# Altium schematic sheet KST-51开发板原理图.SchDoc: STM32F107 Core Board
size 469 x 297 mm; Organization: Kingst; DocumentNumber: CB3201; Revision: 1.00.00; SheetNumber: 1; SheetTotal: 1; PageSetup: Record=PageOptions|CenterHorizontal=True|CenterVertical=True|PrintScale=0.85|XCorrection=1.00|YCorrection=1.00|PrintKind=2|BorderSize=5000000|LeftOffset=0|BottomOffset=0|Orientation=2|PaperLength=4200|PaperWidth=2970|Scale=100|PaperSource=15|PrintQuality=300|MediaType=1|DitherType=10|PaperKind=A3|PrintScaleMode=1
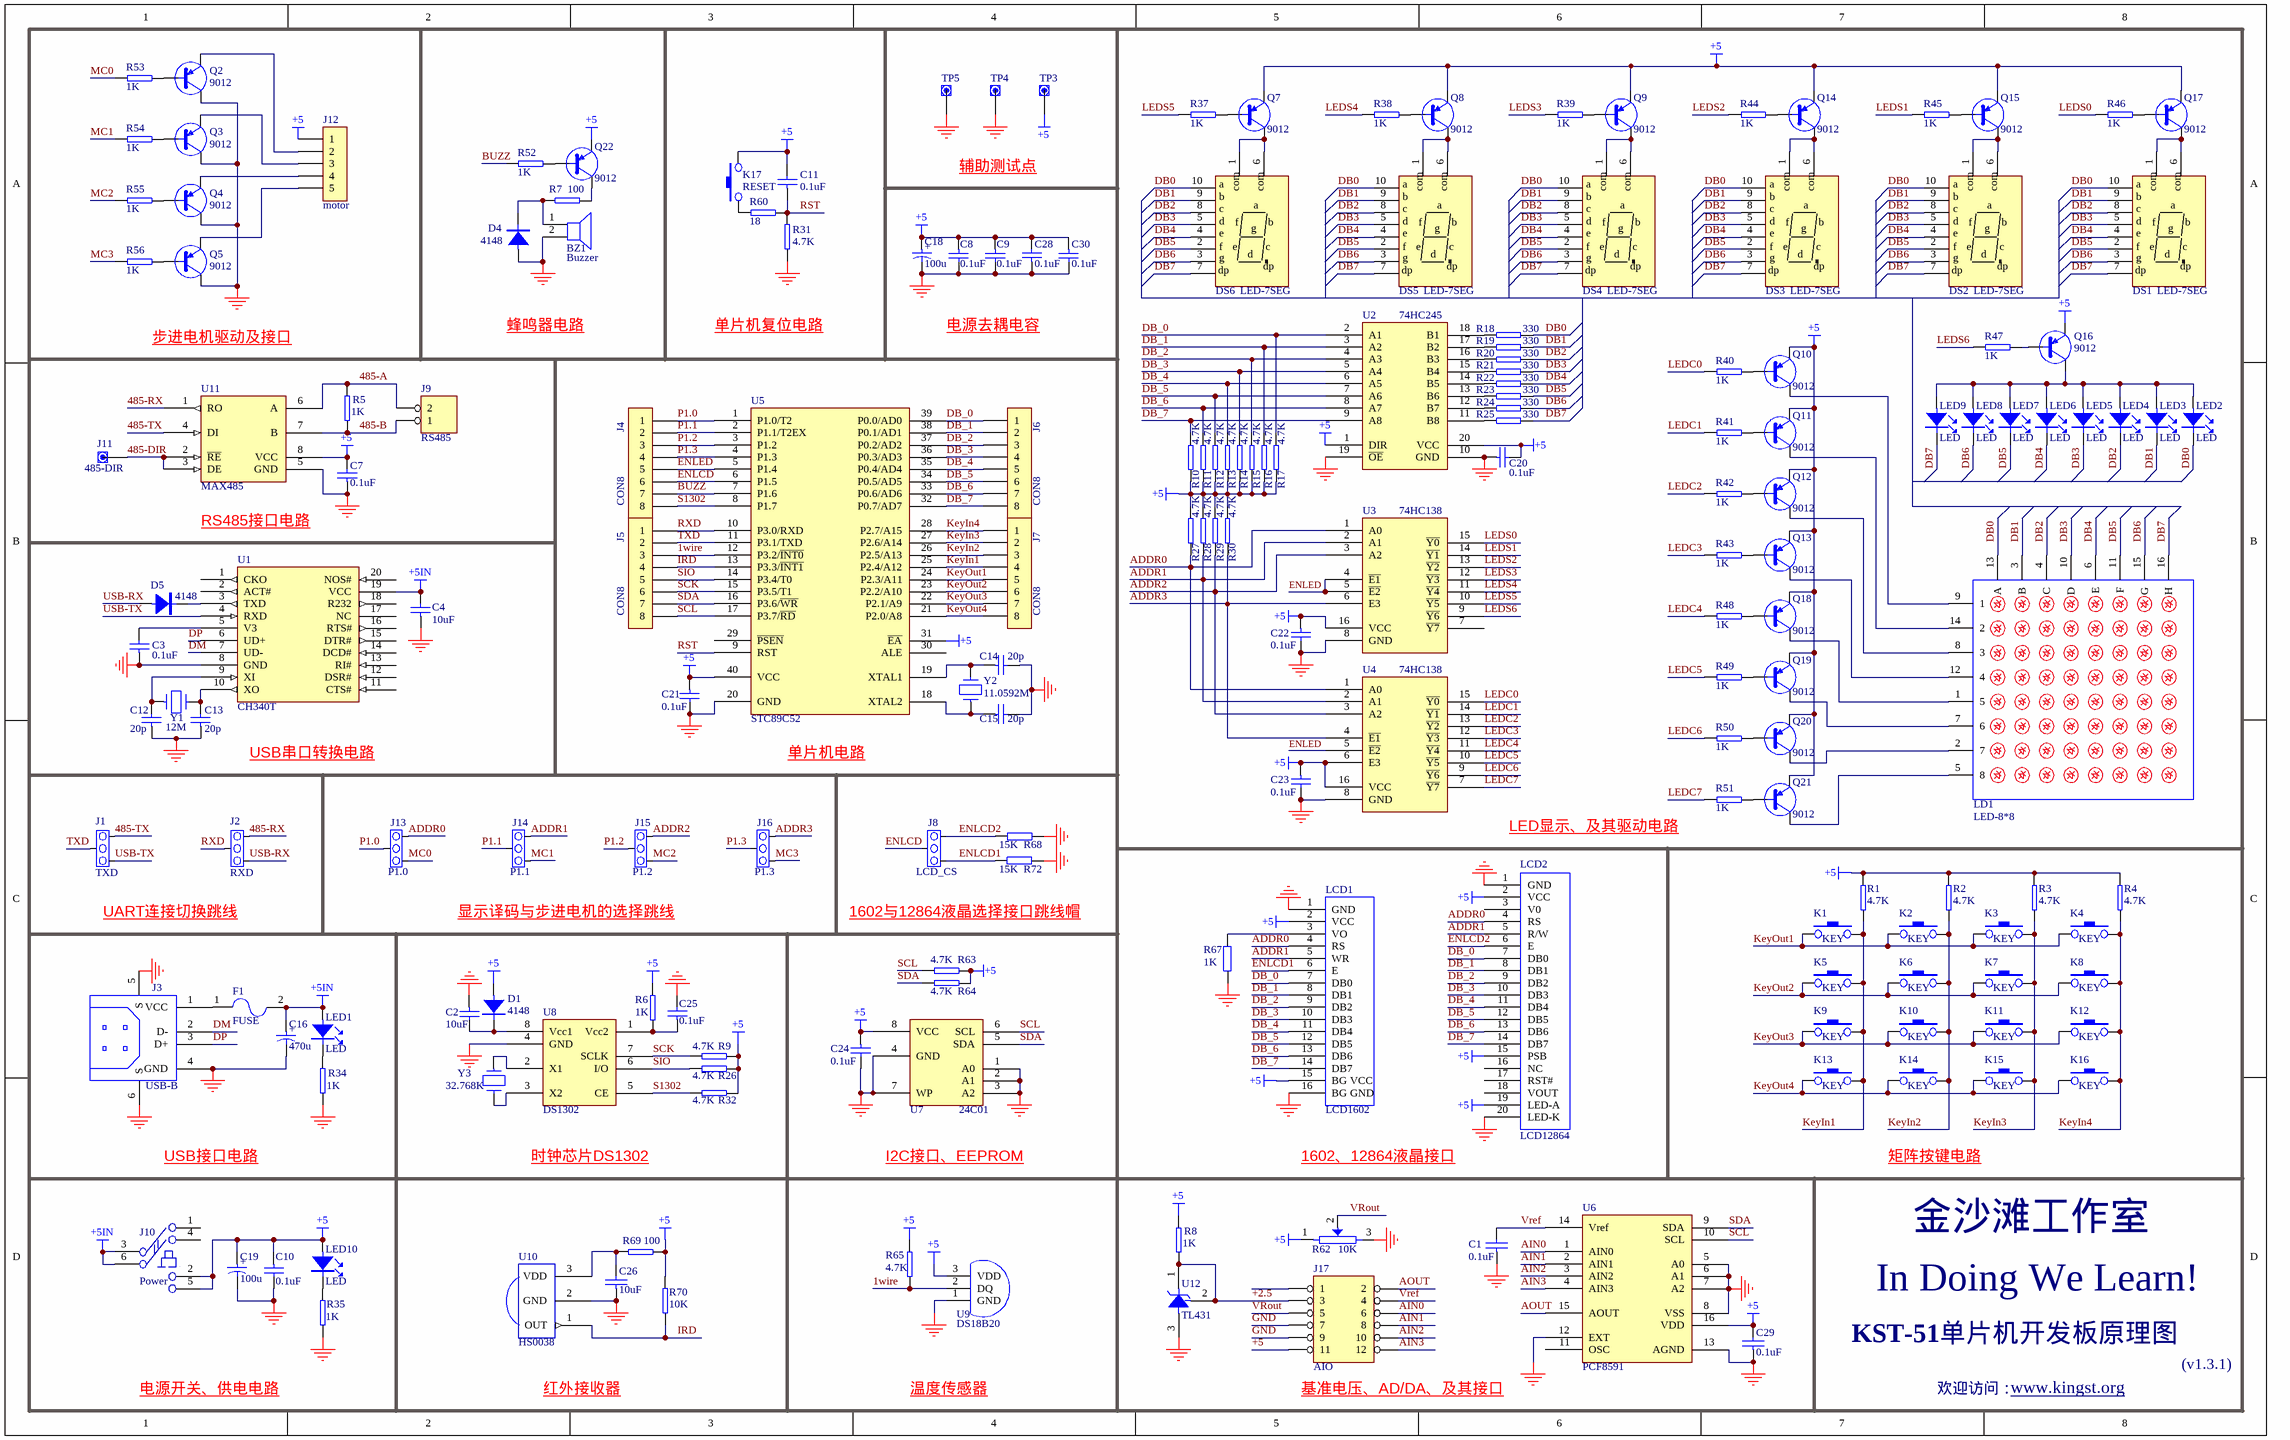
[diagram p0: KST-51开发板原理图.SchDoc]

## Parts
BZ1  Buzzer  [BUZZ-2]
C1  0.1uF  [0805C]
C2  10uF  [0805C]
C3  0.1uF  [0805C]
C4  10uF  [0805C]
C7  0.1uF  [0805C]
C8  0.1uF  [0805C]
C9  0.1uF  [0805C]
C10  0.1uF  [0805C]
C11  0.1uF  [0805C]
C12  20p  [0805C]
C13  20p  [0805C]
C14  20p  [0805C]
C15  20p  [0805C]
C16  470u  [RB.1/.24]
C18  100u  [RB.09/.2]
C19  100u  [RB.09/.2]
C20  0.1uF  [0805C]
C21  0.1uF  [0805C]
C22  0.1uF  [0805C]
C23  0.1uF  [0805C]
C24  0.1uF  [0805C]
C25  0.1uF  [0805C]
C26  10uF  [0805C]
C28  0.1uF  [0805C]
C29  0.1uF  [0805C]
C30  0.1uF  [0805C]
D1  4148  [1206D]
D4  4148  [1206D]
D5  4148  [1206D]
DS1  LED-7SEG  [LED-C7]
DS2  LED-7SEG  [LED-C7]
DS3  LED-7SEG  [LED-C7]
DS4  LED-7SEG  [LED-C7]
DS5  LED-7SEG  [LED-C7]
DS6  LED-7SEG  [LED-C7]
F1  FUSE  [1812]
J1  TXD  [JP3*1]
J2  RXD  [JP3*1]
J3  USB-B  [USB-B]
J4  CON8  [SIP8]
J5  CON8  [SIP8]
J6  CON8  [SIP8]
J7  CON8  [SIP8]
J8  LCD_CS  [JP3*1]
J9  RS485  [PLUG2-5.08]
J10  Power
J11  485-DIR  [TP]
J12  motor  [PLUG-S5]
J13  P1.0  [JP3*1]
J14  P1.1  [JP3*1]
J15  P1.2  [JP3*1]
J16  P1.3  [JP3*1]
J17  AIO  [IDC6X2-M]
K1  KEY  [KEY-6*6]
K2  KEY  [KEY-6*6]
K3  KEY  [KEY-6*6]
K4  KEY  [KEY-6*6]
K5  KEY  [KEY-6*6]
K6  KEY  [KEY-6*6]
K7  KEY  [KEY-6*6]
K8  KEY  [KEY-6*6]
K9  KEY  [KEY-6*6]
K10  KEY  [KEY-6*6]
K11  KEY  [KEY-6*6]
K12  KEY  [KEY-6*6]
K13  KEY  [KEY-6*6]
K14  KEY  [KEY-6*6]
K15  KEY  [KEY-6*6]
K16  KEY  [KEY-6*6]
K17  RESET  [KEY-6*6]
LCD1  LCD1602  [LCD1602]
LCD2  LCD12864  [SIP20]
LD1  LED-8*8  [LED-8*8]
LED1  LED  [0805LED]
LED2  LED  [0805LED]
LED3  LED  [0805LED]
LED4  LED  [0805LED]
LED5  LED  [0805LED]
LED6  LED  [0805LED]
LED7  LED  [0805LED]
LED8  LED  [0805LED]
LED9  LED  [0805LED]
LED10  LED  [0805LED]
Q2  9012  [SOT-23-2N]
Q3  9012  [SOT-23-2N]
Q4  9012  [SOT-23-2N]
Q5  9012  [SOT-23-2N]
Q7  9012  [SOT-23-2N]
Q8  9012  [SOT-23-2N]
Q9  9012  [SOT-23-2N]
Q10  9012  [SOT-23-2N]
Q11  9012  [SOT-23-2N]
Q12  9012  [SOT-23-2N]
Q13  9012  [SOT-23-2N]
Q14  9012  [SOT-23-2N]
Q15  9012  [SOT-23-2N]
Q16  9012  [SOT-23-2N]
Q17  9012  [SOT-23-2N]
Q18  9012  [SOT-23-2N]
Q19  9012  [SOT-23-2N]
Q20  9012  [SOT-23-2N]
Q21  9012  [SOT-23-2N]
Q22  9012  [SOT-23-2N]
R1  4.7K  [0805]
R2  4.7K  [0805]
R3  4.7K  [0805]
R4  4.7K  [0805]
R5  1K  [0805]
R6  1K  [0805]
R7  100  [0805]
R8  1K  [0805]
R9  4.7K  [0805]
R10  4.7K  [0805]
R11  4.7K  [0805]
R12  4.7K  [0805]
R13  4.7K  [0805]
R14  4.7K  [0805]
R15  4.7K  [0805]
R16  4.7K  [0805]
R17  4.7K  [0805]
R18  330  [0805]
R19  330  [0805]
R20  330  [0805]
R21  330  [0805]
R22  330  [0805]
R23  330  [0805]
R24  330  [0805]
R25  330  [0805]
R26  4.7K  [0805]
R27  4.7K  [0805]
R28  4.7K  [0805]
R29  4.7K  [0805]
R30  4.7K  [0805]
R31  4.7K  [0805]
R32  4.7K  [0805]
R34  1K  [0805]
R35  1K  [0805]
R37  1K  [0805]
R38  1K  [0805]
R39  1K  [0805]
R40  1K  [0805]
R41  1K  [0805]
R42  1K  [0805]
R43  1K  [0805]
R44  1K  [0805]
R45  1K  [0805]
R46  1K  [0805]
R47  1K  [0805]
R48  1K  [0805]
R49  1K  [0805]
R50  1K  [0805]
R51  1K  [0805]
R52  1K  [0805]
R53  1K  [0805]
R54  1K  [0805]
R55  1K  [0805]
R56  1K  [0805]
R60  18  [0805]
R62  10K  [VR6]
R63  4.7K  [0805]
R64  4.7K  [0805]
R65  4.7K  [0805]
R67  1K  [0805]
R68  15K  [0805]
R69  100  [0805]
R70  10K  [0805]
R72  15K  [0805]
TP3  +5V  [TP-S]  (value not drawn)
TP4  GND  [TP-S]  (value not drawn)
TP5  GND  [TP-S]  (value not drawn)
U1  CH340T  [SSOP20-5.3]
U2  74HC245  [SOP20-400]
U3  74HC138  [SOP16-240]
U4  74HC138  [SOP16-240]
U5  STC89C52  [DIP40-PLUG]
U6  PCF8591  [SOP16-400]
U7  24C01  [SOP8]
U8  DS1302  [SOP8]
U9  DS18B20  [TO-92]
U10  HS0038  [HS0038]
U11  MAX485  [SOP8-3.9]
U12  TL431  [SOT-23-3L]
Y1  12M  [XTAL]
Y2  11.0592M  [XTAL]
Y3  32.768K  [XTAL2]

## Nets
+5: C7.2 C8.1 C9.1 C10.1 C11.2 C18.1 C19.1 C20.2 C21.1 C22.1 C23.1 C24.1 C28.2 C29.2 C30.1 D1.A J10.2 J10.5 J12.1 J17.11 K17.2 LCD1.2(VCC) LCD1.15(BG_VCC) LCD2.2(VCC) LCD2.15(PSB) LCD2.19(LED-A) LED10.A Q7.E Q8.E Q9.E Q10.E Q11.E Q12.E Q13.E Q14.E Q15.E Q16.E Q17.E Q18.E Q19.E Q20.E Q21.E Q22.E R1.2 R2.2 R3.2 R4.2 R6.2 R8.2 R9.2 R10.1 R11.1 R12.1 R13.1 R14.1 R15.1 R16.1 R17.1 R26.2 R27.2 R28.2 R29.2 R30.2 R32.2 R62.1 R63.2 R64.2 R65.2 R69.2 R70.1 TP3.1 U2.1(DIR) U2.20(VCC) U3.16(VCC) U4.6(E3) U4.16(VCC) U5.31(~{EA}) U5.40(VCC) U6.16(VDD) U7.8(VCC) U9.3(VDD) U11.8(VCC)
+5IN: C4.2 C16.1 F1.2 J10.3 J10.6 LED1.A U1.19(VCC)
GND: BZ1.2 C1.1 C2.1 C3.1 C4.1 C7.1 C8.2 C9.2 C10.2 C12.1 C13.1 C14.2 C15.2 C16.2 C18.2 C19.2 C20.1 C21.2 C22.2 C23.2 C24.2 C25.2 C26.1 C28.1 C29.1 C30.2 D4.A J3.4(GND) J3.5(S) J3.6(S) J17.7 J17.9 LCD1.1(GND) LCD1.16(BG_GND) LCD2.1(GND) LCD2.20(LED-K) Q2.C Q3.C Q4.C Q5.C R31.2 R34.2 R35.2 R62.3 R67.1 R68.2 R72.1 TP4.1 TP5.1 U1.8(GND) U2.10(GND) U2.19(~{OE}) U3.8(GND) U4.8(GND) U5.20(GND) U6.5(A0) U6.6(A1) U6.7(A2) U6.8(VSS) U6.12(EXT) U6.13(AGND) U7.1(A0) U7.2(A1) U7.3(A2) U7.4(GND) U7.7(WP) U8.4(GND) U9.1(GND) U10.2(GND) U11.5(GND) U12.3(ANODE)
1wire: J5.3 R65.1 U5.12(P3.2/~{INT0}) U9.2(DQ)
485-A: J9.2 R5.1 U11.6(A)
485-B: J9.1 R5.2 U11.7(B)
485-DIR: J11.1 U11.2(~{RE}) U11.3(DE)
485-RX: J2.3 U11.1(RO)
485-TX: J1.3 U11.4(DI)
+2.5: J17.3 R8.1 U12.1(CATHODE) U12.2(REF)
ADDR0: J13.1 LCD1.4(RS) LCD2.4(RS) R27.1 U3.1(A0) U4.1(A0)
ADDR1: J14.1 LCD1.5(WR) LCD2.5(R/W) R28.1 U3.2(A1) U4.2(A1)
ADDR2: J15.1 R29.1 U3.3(A2) U4.3(A2)
ADDR3: J16.1 R30.1 U3.6(E3) U4.4(~{E1})
AIN0: J17.6 U6.1(AIN0)
AIN1: J17.8 U6.2(AIN1)
AIN2: J17.10 U6.3(AIN2)
AIN3: J17.12 U6.4(AIN3)
AOUT: J17.2 U6.15(AOUT)
BUZZ: J4.7 R52.1 U5.7(P1.6)
DB0: DS1.10(a) DS2.10(a) DS3.10(a) DS4.10(a) DS5.10(a) DS6.10(a) LD1.13(A) LED2.K R18.1
DB1: DS1.9(b) DS2.9(b) DS3.9(b) DS4.9(b) DS5.9(b) DS6.9(b) LD1.3(B) LED3.K R19.1
DB2: DS1.8(c) DS2.8(c) DS3.8(c) DS4.8(c) DS5.8(c) DS6.8(c) LD1.4(C) LED4.K R20.1
DB3: DS1.5(d) DS2.5(d) DS3.5(d) DS4.5(d) DS5.5(d) DS6.5(d) LD1.10(D) LED5.K R21.1
DB4: DS1.4(e) DS2.4(e) DS3.4(e) DS4.4(e) DS5.4(e) DS6.4(e) LD1.6(E) LED6.K R22.1
DB5: DS1.2(f) DS2.2(f) DS3.2(f) DS4.2(f) DS5.2(f) DS6.2(f) LD1.11(F) LED7.K R23.1
DB6: DS1.3(g) DS2.3(g) DS3.3(g) DS4.3(g) DS5.3(g) DS6.3(g) LD1.15(G) LED8.K R24.1
DB7: DS1.7(dp) DS2.7(dp) DS3.7(dp) DS4.7(dp) DS5.7(dp) DS6.7(dp) LD1.16(H) LED9.K R25.1
DB_0: J6.1 LCD1.7(DB0) LCD2.7(DB0) R17.2 U2.2(A1) U5.39(P0.0/AD0)
DB_1: J6.2 LCD1.8(DB1) LCD2.8(DB1) R16.2 U2.3(A2) U5.38(P0.1/AD1)
DB_2: J6.3 LCD1.9(DB2) LCD2.9(DB2) R15.2 U2.4(A3) U5.37(P0.2/AD2)
DB_3: J6.4 LCD1.10(DB3) LCD2.10(DB3) R14.2 U2.5(A4) U5.36(P0.3/AD3)
DB_4: J6.5 LCD1.11(DB4) LCD2.11(DB4) R13.2 U2.6(A5) U5.35(P0.4/AD4)
DB_5: J6.6 LCD1.12(DB5) LCD2.12(DB5) R12.2 U2.7(A6) U5.34(P0.5/AD5)
DB_6: J6.7 LCD1.13(DB6) LCD2.13(DB6) R11.2 U2.8(A7) U5.33(P0.6/AD6)
DB_7: J6.8 LCD1.14(DB7) LCD2.14(DB7) R10.2 U2.9(A8) U5.32(P0.7/AD7)
DM: J3.2(D-) U1.7(UD-)
DP: J3.3(D+) U1.6(UD+)
ENLCD: J4.6 J8.2 U5.6(P1.5)
ENLCD1: J8.1 LCD1.6(E) R72.2
ENLCD2: J8.3 LCD2.6(E) R68.1
ENLED: J4.5 U3.4(~{E1}) U3.5(~{E2}) U4.5(~{E2}) U5.5(P1.4)
IRD: J5.4 R70.2 U5.13(P3.3/~{INT1}) U10.1(OUT)
KeyIn1: J7.4 K1.1 K5.1 K9.1 K13.1 R1.1 U5.25(P2.4/A12)
KeyIn2: J7.3 K2.1 K6.1 K10.1 K14.1 R2.1 U5.26(P2.5/A13)
KeyIn3: J7.2 K3.1 K7.1 K11.1 K15.1 R3.1 U5.27(P2.6/A14)
KeyIn4: J7.1 K4.1 K8.1 K12.1 K16.1 R4.1 U5.28(P2.7/A15)
KeyOut1: J7.5 K1.2 K2.2 K3.2 K4.2 U5.24(P2.3/A11)
KeyOut2: J7.6 K5.2 K6.2 K7.2 K8.2 U5.23(P2.2/A10)
KeyOut3: J7.7 K9.2 K10.2 K11.2 K12.2 U5.22(P2.1/A9)
KeyOut4: J7.8 K13.2 K14.2 K15.2 K16.2 U5.21(P2.0/A8)
LEDC0: R40.1 U4.15(~{Y0})
LEDC1: R41.1 U4.14(~{Y1})
LEDC2: R42.1 U4.13(~{Y2})
LEDC3: R43.1 U4.12(~{Y3})
LEDC4: R48.1 U4.11(~{Y4})
LEDC5: R49.1 U4.10(~{Y5})
LEDC6: R50.1 U4.9(~{Y6})
LEDC7: R51.1 U4.7(~{Y7})
LEDS0: R46.1 U3.15(~{Y0})
LEDS1: R45.1 U3.14(~{Y1})
LEDS2: R44.1 U3.13(~{Y2})
LEDS3: R39.1 U3.12(~{Y3})
LEDS4: R38.1 U3.11(~{Y4})
LEDS5: R37.1 U3.10(~{Y5})
LEDS6: R47.2 U3.9(~{Y6})
MC0: J13.3 R53.1
MC1: J14.3 R54.1
MC2: J15.3 R55.1
MC3: J16.3 R56.1
P1.0: J4.1 J13.2 U5.1(P1.0/T2)
P1.1: J4.2 J14.2 U5.2(P1.1/T2EX)
P1.2: J4.3 J15.2 U5.3(P1.2)
P1.3: J4.4 J16.2 U5.4(P1.3)
RST: C11.1 R31.1 R60.2 U5.9(RST)
RXD: J2.2 J5.1 U5.10(P3.0/RXD)
S1302: J4.8 R32.1 U5.8(P1.7) U8.5(CE)
SCK: J5.6 R9.1 U5.15(P3.5/T1) U8.7(SCLK)
SCL: J5.8 R63.1 U5.17(P3.7/~{RD}) U6.10(SCL) U7.6(SCL)
SDA: J5.7 R64.1 U5.16(P3.6/~{WR}) U6.9(SDA) U7.5(SDA)
SIO: J5.5 R26.1 U5.14(P3.4/T0) U8.6(I/O)
TXD: J1.2 J5.2 U5.11(P3.1/TXD)
USB-RX: D5.A J2.1
USB-TX: J1.1 U1.4(RXD)
Vref: C1.2 J17.4 U6.14(Vref)
VRout: J17.5 R62.2
NetBZ1_1: BZ1.1 D4.K R7.2
NetC2_2: C2.2 D1.K U8.8(Vcc1)
NetC3_2: C3.2 U1.5(V3)
NetC12_2: C12.2 U1.9(XI) Y1.1
NetC13_2: C13.2 U1.10(XO) Y1.2
NetC14_1: C14.1 U5.19(XTAL1) Y2.2
NetC15_1: C15.1 U5.18(XTAL2) Y2.1
NetC25_1: C25.1 R6.1 U8.1(Vcc2)
NetC26_2: C26.2 R69.1 U10.3(VDD)
NetD5_K: D5.K U1.3(TXD)
NetDS1_1: DS1.1(com) DS1.6(com) Q17.C
NetDS2_1: DS2.1(com) DS2.6(com) Q15.C
NetDS3_1: DS3.1(com) DS3.6(com) Q14.C
NetDS4_1: DS4.1(com) DS4.6(com) Q9.C
NetDS5_1: DS5.1(com) DS5.6(com) Q8.C
NetDS6_1: DS6.1(com) DS6.6(com) Q7.C
NetF1_1: F1.1 J3.1(VCC)
NetJ12_2: J12.2 Q2.E
NetJ12_3: J12.3 Q3.E
NetJ12_4: J12.4 Q4.E
NetJ12_5: J12.5 Q5.E
NetK17_1: K17.1 R60.1
NetLCD1_3: LCD1.3(VO) R67.2
NetLD1_1: LD1.1(5) Q18.C
NetLD1_2: LD1.2(7) Q20.C
NetLD1_5: LD1.5(8) Q21.C
NetLD1_7: LD1.7(6) Q19.C
NetLD1_8: LD1.8(3) Q12.C
NetLD1_9: LD1.9(1) Q10.C
NetLD1_12: LD1.12(4) Q13.C
NetLD1_14: LD1.14(2) Q11.C
NetLED1_K: LED1.K R34.1
NetLED2_A: LED2.A LED3.A LED4.A LED5.A LED6.A LED7.A LED8.A LED9.A Q16.C
NetLED10_K: LED10.K R35.1
NetQ2_B: Q2.B R53.2
NetQ3_B: Q3.B R54.2
NetQ4_B: Q4.B R55.2
NetQ5_B: Q5.B R56.2
NetQ7_B: Q7.B R37.2
NetQ8_B: Q8.B R38.2
NetQ9_B: Q9.B R39.2
NetQ10_B: Q10.B R40.2
NetQ11_B: Q11.B R41.2
NetQ12_B: Q12.B R42.2
NetQ13_B: Q13.B R43.2
NetQ14_B: Q14.B R44.2
NetQ15_B: Q15.B R45.2
NetQ16_B: Q16.B R47.1
NetQ17_B: Q17.B R46.2
NetQ18_B: Q18.B R48.2
NetQ19_B: Q19.B R49.2
NetQ20_B: Q20.B R50.2
NetQ21_B: Q21.B R51.2
NetQ22_B: Q22.B R52.2
NetQ22_C: Q22.C R7.1
NetR18_2: R18.2 U2.18(B1)
NetR19_2: R19.2 U2.17(B2)
NetR20_2: R20.2 U2.16(B3)
NetR21_2: R21.2 U2.15(B4)
NetR22_2: R22.2 U2.14(B5)
NetR23_2: R23.2 U2.13(B6)
NetR24_2: R24.2 U2.12(B7)
NetR25_2: R25.2 U2.11(B8)
NetU8_2: U8.2(X1) Y3.1
NetU8_3: U8.3(X2) Y3.2

Not connected (* = marked no-connect by the designer): J10 1 4; J17 1; LCD2 3(V0) 16(NC) 17(RST#) 18(VOUT); U1 1(CKO) 2(ACT#) 11(CTS#) 12(DSR#) 13(RI#) 14(DCD#) 15(DTR#) 16(RTS#) 17(NC) 18(R232) 20(NOS#); U3 7(~{Y7}); U5 29(~{PSEN}) 30(ALE); U6 11(OSC)

## Notes on the sheet
- 辅助测试点
- 步进电机驱动及接口
- 蜂鸣器电路
- 单片机复位电路
- 电源去耦电容
- RS485接口电路
- USB串口转换电路
- (near U5) 单片机电路
- LED显示、及其驱动电路
- UART连接切换跳线
- (near J14) 显示译码与步进电机的选择跳线
- 1602与12864液晶选择接口跳线帽
- USB接口电路
- 时钟芯片DS1302
- I2C接口、EEPROM
- 1602、12864液晶接口
- 矩阵按键电路
- 金沙滩工作室
- In Doing We Learn!
- 电源开关、供电电路
- 红外接收器
- 温度传感器
- (near J17) 基准电压、AD/DA、及其接口
- KST-51单片机开发板原理图
- 欢迎访问：
- www.kingst.org
- (v1.3.1)
- (in symbol CAP-P) +

## Library data of the parts
BZ1 = SPEAKER
C1 C26 C29 = CAP: Capacitor
C2-C4 C7-C15 C20-C25 C28 C30 = CAP
C16 C18 C19 = CAP-P
D1 D4 D5 = DIODE
DS1-DS6 = LED-7SEG: Seven-Segment Display, Right Hand Decimal
J1 J2 J8 J13-J16 = JP-3
J3 = USB-B: USB B型插座
J4-J7 = CON8: Connector
J9 = CON2: Connector 2p
J10 = KEY-SL: Self-locking button
J11 = TP: Test Point
J12 = CON5: Connector
J17 = CON6X2: Connector 6*2p
K17 = KEY
LCD2 = LCD-12864: 20pin 128*64 LCD
Q2-Q5 Q7-Q22 = 2N-PNP
R1-R32 R34 R35 R37-R56 R60 R63-R65 R69 R70 = RES2
R62 = RES-V
R67 R68 R72 = RES2: 电阻
TP3-TP5 = TP: 电路测试点
U1 = CH340T: USB to UART Bridge Controller
U2 = 74XX245
U3 U4 = 74XX138
U10 = HS0038: Infrared Receiver
U11 = MAX485: RS-485 Transceiver
U12 = TL431-SOT: Adjustable precision shunt regulator, 3p SOT
Y1-Y3 = CRYSTAL